# EAGLE schematic MagusConnectors (EAGLE 9.1.3)
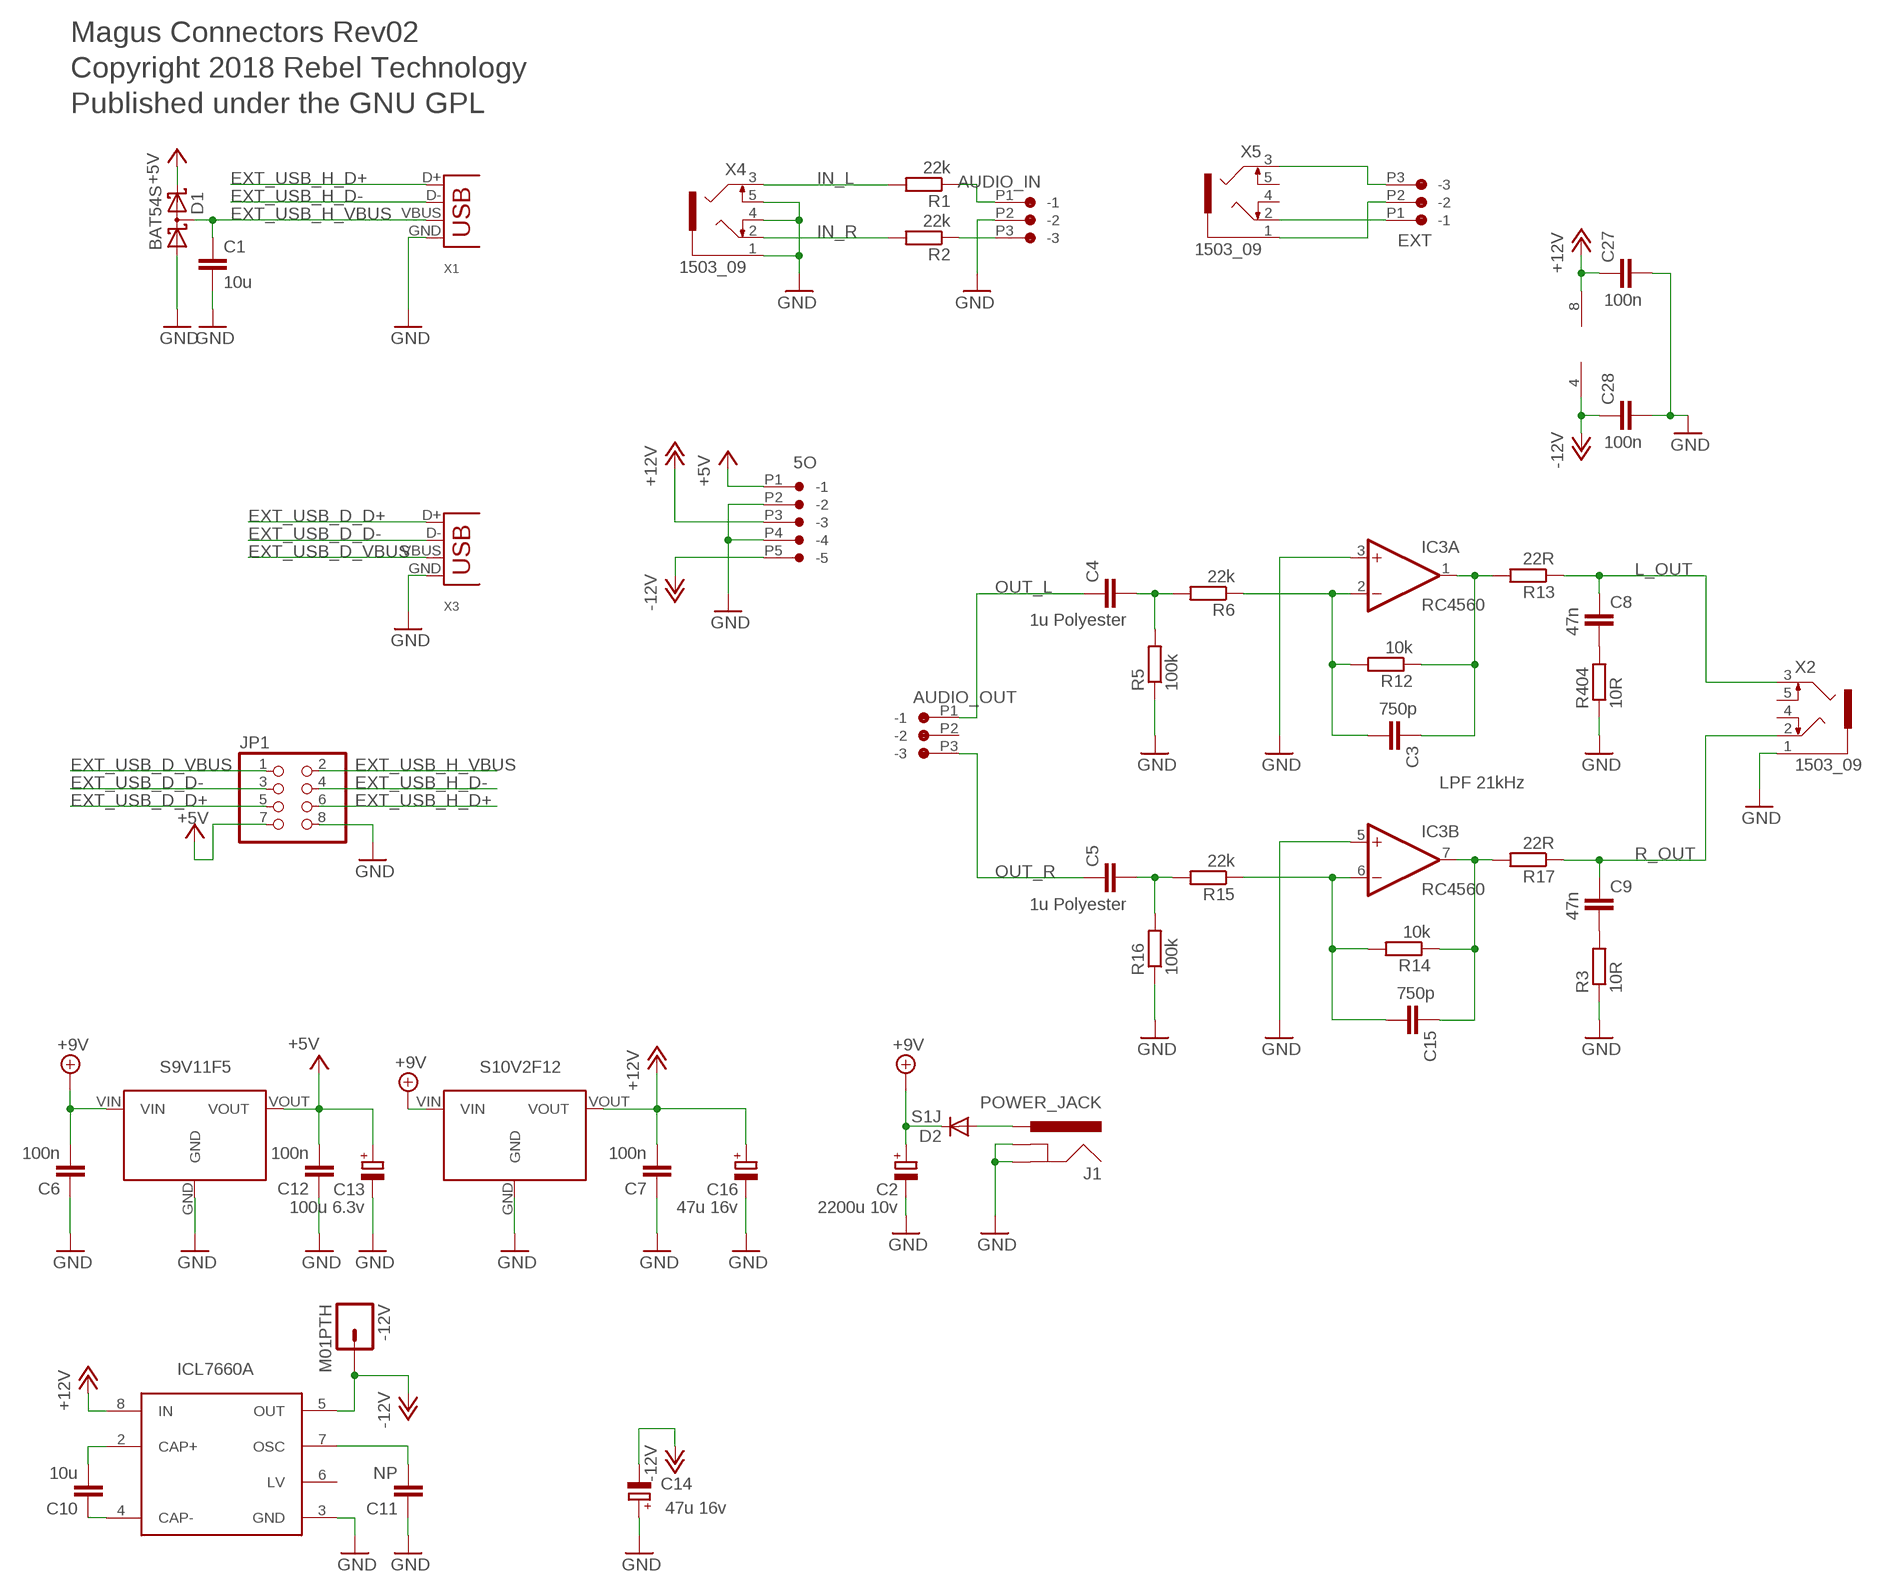
[diagram p0: schematic, sheet 1]

## Parts
5O  CON-JST_PH_5W  [CON-JST_PH_5W]
-12V  M01PTH  [1X01]
AUDIO_IN  CON-JST_PH_3W  [CON-JST_PH_3W]
AUDIO_OUT  CON-JST_PH_3W  [CON-JST_PH_3W]
C1  10u  C-EUC1206  [C1206]
C2  2200u 10v  CPOL-EUD  [PANASONIC_D]
C3  750p  C-EUC0603  [C0603]
C4  1u Polyester  C-EUC1210  [C1210]
C5  1u Polyester  C-EUC1210  [C1210]
C6  100n  C-EUC0603  [C0603]
C7  100n  C-EUC0603  [C0603]
C8  47n  C-EUC0603  [C0603]
C9  47n  C-EUC0603  [C0603]
C10  10u  C-EUC1206  [C1206]
C11  NP  C-EUC0603  [C0603]
C12  100n  C-EUC0603  [C0603]
C13  100u 6.3v  CPOL-EUB  [PANASONIC_B]
C14  47u 16v  CPOL-EUB  [PANASONIC_B]
C15  750p  C-EUC0603  [C0603]
C16  47u 16v  CPOL-EUB  [PANASONIC_B]
C27  100n  C-EUC0603  [C0603]
C28  100n  C-EUC0603  [C0603]
D1  BAT54S  [SOT23]
D2  S1J  DIODESMA  [SMA-DIODE]
EXT  CON-JST_PH_3W  [CON-JST_PH_3W]
IC3  RC4560  NE5532D  [SO08]
J1  POWER_JACK  [DC_JACK_SLOT]
JP1  PINHD-2X4  [2X04]
R1  22k  R-EU_R0603  [R0603]
R2  22k  R-EU_R0603  [R0603]
R3  10R  R-EU_R0603  [R0603]
R5  100k  R-EU_R0603  [R0603]
R6  22k  R-EU_R0603  [R0603]
R12  10k  R-EU_R0603  [R0603]
R13  22R  R-EU_R0603  [R0603]
R14  10k  R-EU_R0603  [R0603]
R15  22k  R-EU_R0603  [R0603]
R16  100k  R-EU_R0603  [R0603]
R17  22R  R-EU_R0603  [R0603]
R404  10R  R-EU_R0603  [R0603]
U1  S9V11F5  REG_S9V11F5  [REG_S9V11F5]
U2  S10V2F12  REG_S9V11F5  [REG_S9V11F5]
U3  ICL7660A  ICL7660  [SOIC8]
X1  USB-A-H  [USB-A-H]
X2  1503_09  [1503_09]
X3  USB-B-H  [USB-B-H]
X4  1503_09  [1503_09]
X5  1503_09  [1503_09]

## Nets
+5V: 5O.P1(-1) C12.2 C13.+ D1.2(C2) JP1.7 U1.VOUT
+9V: C2.+ C6.2 D2.C U1.VIN U2.VIN
+12V: 5O.P3(-3) C7.2 C16.+ C27.1 IC3.8(P:V+) U2.VOUT U3.8(IN)
-12V: 5O.P5(-5) -12V.1 C14.- C28.1 IC3.4(P:V-) U3.5(OUT)
EXT_USB_D_D+: JP1.5 X3.D+
EXT_USB_D_D-: JP1.3 X3.D-
EXT_USB_D_VBUS: JP1.1 X3.VBUS
EXT_USB_H_D+: JP1.6 X1.D+
EXT_USB_H_D-: JP1.4 X1.D-
EXT_USB_H_VBUS: C1.1 D1.3(C1A2) JP1.2 X1.VBUS
GND: 5O.P2(-2) 5O.P4(-4) AUDIO_IN.P2(-2) C1.2 C2.- C6.1 C7.1 C11.1 C12.1 C13.- C14.+ C16.- C27.2 C28.2 D1.1(A1) IC3.3(A:+IN) IC3.5(B:+IN) J1.GND J1.GNDBREAK JP1.8 R3.1 R5.1 R16.1 R404.1 U1.GND U2.GND U3.3(GND) X1.GND X2.1 X3.GND X4.1 X4.4 X4.5
IN_L: R1.2 X4.3
IN_R: R2.2 X4.2
L_OUT: C8.1 R13.1 X2.3
N$1: C15.2 IC3.6(B:-IN) R14.2 R15.1
N$2: C15.1 IC3.7(B:OUT) R14.1 R17.2
N$3: C3.2 IC3.2(A:-IN) R6.1 R12.2
N$4: C5.2 R15.2 R16.2
N$5: AUDIO_IN.P3(-3) R2.1
N$6: AUDIO_IN.P1(-1) R1.1
N$7: EXT.P1(-1) X5.2
N$8: C4.2 R5.2 R6.2
N$9: D2.A J1.PWR
N$10: C10.1 U3.4(CAP-)
N$11: C10.2 U3.2(CAP+)
N$12: C9.2 R3.2
N$13: C11.2 U3.7(OSC)
N$14: EXT.P3(-3) X5.3
N$15: EXT.P2(-2) X5.1
N$19: C3.1 IC3.1(A:OUT) R12.1 R13.2
N$21: C8.2 R404.2
OUT_L: AUDIO_OUT.P1(-1) C4.1
OUT_R: AUDIO_OUT.P3(-3) C5.1
R_OUT: C9.1 R17.1 X2.2
Unconnected: AUDIO_OUT.P2(-2) U3.6(LV) X2.4 X2.5 X5.4 X5.5

## Notes on the sheet
- Magus Connectors Rev02
- Copyright 2018 Rebel Technology
- Published under the GNU GPL
- LPF 21kHz

## Library data of the parts
5O = Rebel:CON-JST_PH_5W
-12V = SparkFun:M01: Header 1 Standard 1-pin 0.1" header. Use with straight break away headers (SKU : PRT-00116), right angle break away headers (PRT-00553), swiss pins (PRT-00743), machine pins (PRT-00117), and female headers (PRT-00115).
AUDIO_IN AUDIO_OUT EXT = Rebel:CON-JST_PH_3W
C1 C3-C5 C8 C9 C15 C27 C28 = Rebel:C-EU: CAPACITOR, European symbol
C2 C13 C14 C16 = Rebel:CPOL-EU: POLARIZED CAPACITOR, European symbol
C6 C7 C10-C12 = rcl:C-EU: CAPACITOR, European symbol
D1 = diode:BAT54S: Schottky Diodes Pin connection corrected 2011-05-04 Source: Fairchild .. BAT54.pdf
D2 = SparkFun:DIODE: Diode These are standard reverse protection diodes and small signal diodes. SMA package can handle up to about 1A. SOD-323 can handle about 200mA. What the SOD-323 package when ordering, there are some mfgs out there that are 5-pin packages.
IC3 = linear:NE5532: AUDIO AMPLIFIER
J1 = Rebel:POWER_JACK: Power Jack This is the standard 5.5mm barrel jack for power. The PTH is the most common, proven, reliable, footprint. All others are experimental. The Slot footprint only works if the mill layer is transmitted to the PCB fab house so be warned. Spark Fun Electronics SKU : PRT-00119. Mating wall wart : TOL-00298 (and others)
JP1 = pinhead:PINHD-2X4: PIN HEADER
R1-R3 R5 R6 R12-R17 R404 = resistor:R-EU_: RESISTOR, European symbol
U1 U2 = Rebel:REG_S9V11F5
U3 = Rebel:ICL7660
X1 X3 = con-usb-3:USB: USB Connectors
X2 X4 X5 = con-lumberg:1503_09: Jack connectors according to JISC 6560, 3.5 mm Klinkeneinbaukupplung nach JISC 6560, 3,5 mm, 3-polig/ stereo, abgewinkelte Ausführung, mit 2 Öffnern und Lötaugen, für Leiterplatten Rückseitenmontage Source: http://www.lumberg.com/Produkte/PDFs/1503_09.pdf; OC_FARNELL: 1243244; OC_NEWARK: unknown

## Net classes
1 power: width 0.178 mm, drill 0.305 mm, clearance 0.178 mm to class 0, clearance 0.178 mm